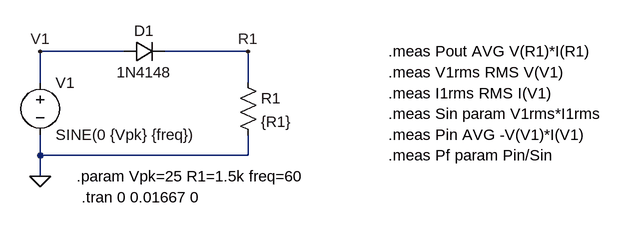
[diagram p0: schematic DR01tran.asc]
DR01tran.asc, the LTspice schematic file:
Version 4
SHEET 1 952 680
WIRE 176 0 48 0
WIRE 368 0 240 0
WIRE 48 48 48 0
WIRE 368 48 368 0
WIRE 48 160 48 128
WIRE 368 160 368 128
WIRE 368 160 48 160
WIRE 48 192 48 160
FLAG 48 192 0
FLAG 368 0 R1
FLAG 48 0 V1
SYMBOL voltage 48 32 R0
WINDOW 123 0 0 Left 0
WINDOW 39 0 0 Left 0
SYMATTR InstName V1
SYMATTR Value SINE(0 {Vpk} {freq})
SYMBOL diode 176 16 R270
WINDOW 0 32 32 VTop 2
WINDOW 3 0 32 VBottom 2
SYMATTR InstName D1
SYMATTR Value 1N4148
SYMBOL res 352 32 R0
SYMATTR InstName R1
SYMATTR Value {R1}
TEXT 104 192 Left 2 !.param Vpk=25 R1=1.5k freq=60
TEXT 112 224 Left 2 !.tran 0 0.01667 0
TEXT 584 0 Left 2 !.meas Pout AVG V(R1)*I(R1)
TEXT 584 32 Left 2 !.meas V1rms RMS V(V1)
TEXT 584 64 Left 2 !.meas I1rms RMS I(V1)
TEXT 584 96 Left 2 !.meas Sin param V1rms*I1rms
TEXT 584 128 Left 2 !.meas Pin AVG -V(V1)*I(V1)
TEXT 584 160 Left 2 !.meas Pf param Pin/Sin

The netlist it stands for:
* DR01tran.asc
V1 V1 0 SINE(0 {Vpk} {freq})
D1 V1 R1 1N4148
R1 R1 0 {R1}
.model D D
.lib standard.dio
.param Vpk=25 R1=1.5k freq=60
.tran 0 0.01667 0
.meas Pout AVG V(R1)*I(R1)
.meas V1rms RMS V(V1)
.meas I1rms RMS I(V1)
.meas Sin param V1rms*I1rms
.meas Pin AVG -V(V1)*I(V1)
.meas Pf param Pin/Sin
.backanno
.end